# EAGLE design Stab (EAGLE 7.1.0)
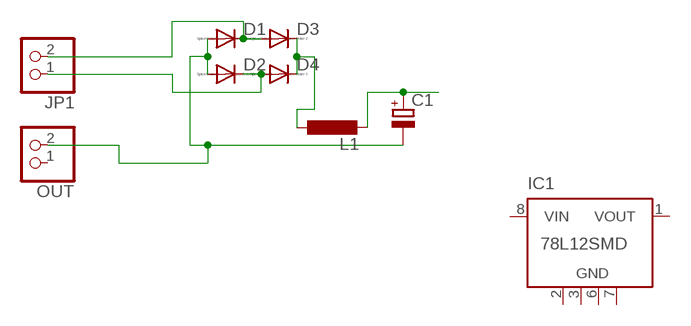
[diagram p0: schematic, sheet 1]

## Parts
C1  CPOL-EU153CLV-0605  [153CLV-0605]
D1  DIODE-DO214AC  [DO214AC]
D2  DIODE-DO214AC  [DO214AC]
D3  DIODE-DO214AC  [DO214AC]
D4  DIODE-DO214AC  [DO214AC]
IC1  78L12SMD  [SO08]
JP1  PINHD-1X2/90  [1X02/90]
L1  L-EUPIS2816  [PIS2816]
OUT  PINHD-1X2/90  [1X02/90]

## Nets
AC1: D1.C D3.A JP1.2
AC2: D2.C D4.A JP1.1
GND: C1.- D1.A D2.A OUT.2
N$4: D3.C D4.C L1.1
VCC: C1.+ L1.2
Unconnected: IC1.1(VOUT) IC1.4(NC) IC1.5(NC) IC1.8(VIN) OUT.1

## Power pins joined to a net without a drawn wire
GND: IC1.2(GND) IC1.3(GND) IC1.6(GND) IC1.7(GND)

## Library data of the parts
C1 = rcl:CPOL-EU: POLARIZED CAPACITOR, European symbol
D1-D4 = diode:DIODE-: DIODE
IC1 = linear:78L*SMD: Positive VOLTAGE REGULATOR
JP1 OUT = pinhead:PINHD-1X2: PIN HEADER
L1 = rcl:L-EU: INDUCTOR, European symbol

## Board
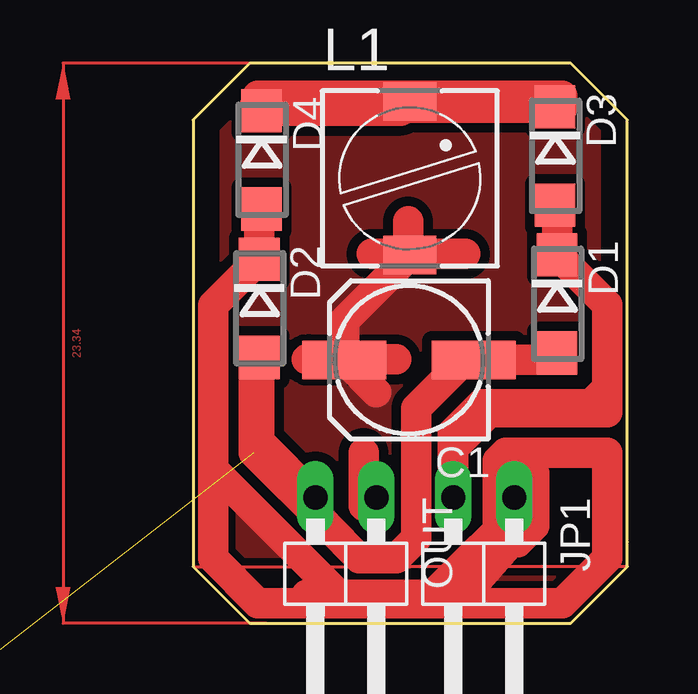
[diagram p1: board, top side]

Size 18.1 x 23.34 mm. Coordinates in mm from the lower left corner, seen from the top.
Outline: 2.37,0 0,2.37 0,20.98 2.37,23.35 15.73,23.35 18.1,20.98 18.1,3.38 18.1,2.37 15.73,0 5.75,0 2.37,0
Outline: 2.37,0 2.37,0
Outline: 2.37,0 2.37,0
Copper layers (1*16): Top 0.035mm / dielectric 1.5mm / Bottom 0.035mm
Design rules "default *": minimum track width 25mil, minimum drill 24mil, track to track 12mil, track to pad 12mil, pad to pad 12mil, via to via 12mil, smd to smd 8mil, copper to edge 40mil, drill to drill 8mil, minimum pad ring 10mil, minimum via ring 8mil, stop-mask expansion 4mil, vias tented up to drill 0mil, thermal gap 10mil

### Footprints (pad centres in the part's own frame; a part is rotated, then mirrored left to right if it is on the bottom)
153CLV-0605 = smd 3.5 x 1.6: + 2.7,0; - -2.7,0
DO214AC = smd 1.8 x 1.7: A 2.05,0; C -2.05,0
SO08 = smd 0.6 x 2.2: 1 -1.905,-2.6; 2 -0.635,-2.6; 3 0.635,-2.6; 4 1.905,-2.6; 5 1.905,2.6; 6 0.635,2.6; 7 -0.635,2.6; 8 -1.905,2.6
1X02/90 = drill 1.016 long: 1 -1.27,-3.81; 2 1.27,-3.81
PIS2816 = smd 2.2 x 1.6: 1 0,3.2; 2 0,-3.2

### Placement (x,y rotation side)
C1  8.99,10.98 180 top
D1  15.17,13.31 270 top
D2  2.76,13.13 270 top
D3  15.08,19.48 270 top
D4  2.85,19.32 270 top
IC1  -12.01,-6.26 0 top  (outside the outline)
JP1  12.11,1.43 180 top
L1  9.03,18.54 0 top
OUT  6.37,1.43 180 top

### Tracks (layer width: path | path; a pad name or v marks a point on that pad's centre or on a via)
AC1
  Top 1.27: JP1.2 10.84,7.29 12.35,8.8 16.07,8.8 | 16.07,8.8 16.24,8.8 17.09,9.64 | 17.09,9.64 17.25,9.81 17.25,10.66 | 17.25,10.66 17.25,11.5 | 17.25,11.5 17.25,13.28 D1.C 15.17,17.34 D3.A | 10.83,5.24 10.83,7.95 12.01,9.14 16.58,9.14 17.09,9.64 | 16.07,8.8 17.25,8.8 17.25,10.66 | 17.25,10.66 17.25,11.5
AC2
  Top 1.27: JP1.1 13.38,3.57 11,0.85 6.43,0.85 0.85,6.43 0.85,13.26 D2.C 2.76,17.17 D4.A
  pour Top: -0.17,6.43 1.69,6.43 1.69,6.09 6.43,1.52 9.81,1.52 12.18,3.89 12.18,6.94 12.86,7.61 18.1,7.61 18.1,2.37 15.73,0 2.37,0 0,2.37 0,6.26
GND  (4 unrouted)
  Top 1.27: D2.A 2.76,7.58 OUT.2 5.1,4.54 5.58,4.06 | 5.58,4.06 6.94,2.71 8.46,2.71 9.3,3.55 9.3,8.97 11.32,10.98 C1.- 14.88,10.98 D1.A | 5.58,4.06 | 5.58,4.06 2.54,7.11 2.54,10.49
N$1
  Top 1.27: 2.71,21.99 15.39,21.99 15.39,21.48 2.54,21.48
N$2
  Top 1.27: 3.21,0.85 15.39,0.85 17.25,2.71 17.25,7.11 13.03,7.11 12.69,6.77 12.69,3.38 13.53,3.38 14.21,4.06 14.21,6.26 14.04,6.43 14.04,5.24 9.98,1.18 4.74,1.18
N$3
  Top 1.27: 3.05,0.85 2.71,0.85 0.85,2.71 0.85,6.26
N$4
  Top 1.27: D4.C 8.66,21.37 L1.1 14.87,21.74 D3.C
  pour Top (isolate 0.406): 2.03,20.64 2.03,23.01 2.37,23.34 15.73,23.34 16.58,22.5 16.58,21.99 15.56,20.98 2.37,20.98
N$5
  Top 1.27: 7.27,4.91 7.11,4.91 7.11,7.11
N$6
  Top 1.27: 7.27,11 8.46,11
N$7
  Top 1.27: 4.91,11 4.74,11
N$8
  Top 1.27: 7.44,15.39 8.8,15.39
N$9
  Top 1.27: 8.97,16.75 8.97,15.39 11.33,15.39
VCC
  Top 1.27: 7.64,9.63 C1.+ 6.29,12.6 L1.2
  pour Top (isolate 0.406): 0,20.98 0,2.37 2.37,0 15.73,0 18.1,2.37 18.1,20.98 15.73,23.34 2.37,23.34
(copper drawn outside any net)
  shapes: Top area x2